# EAGLE design MD01 (EAGLE 5.07)
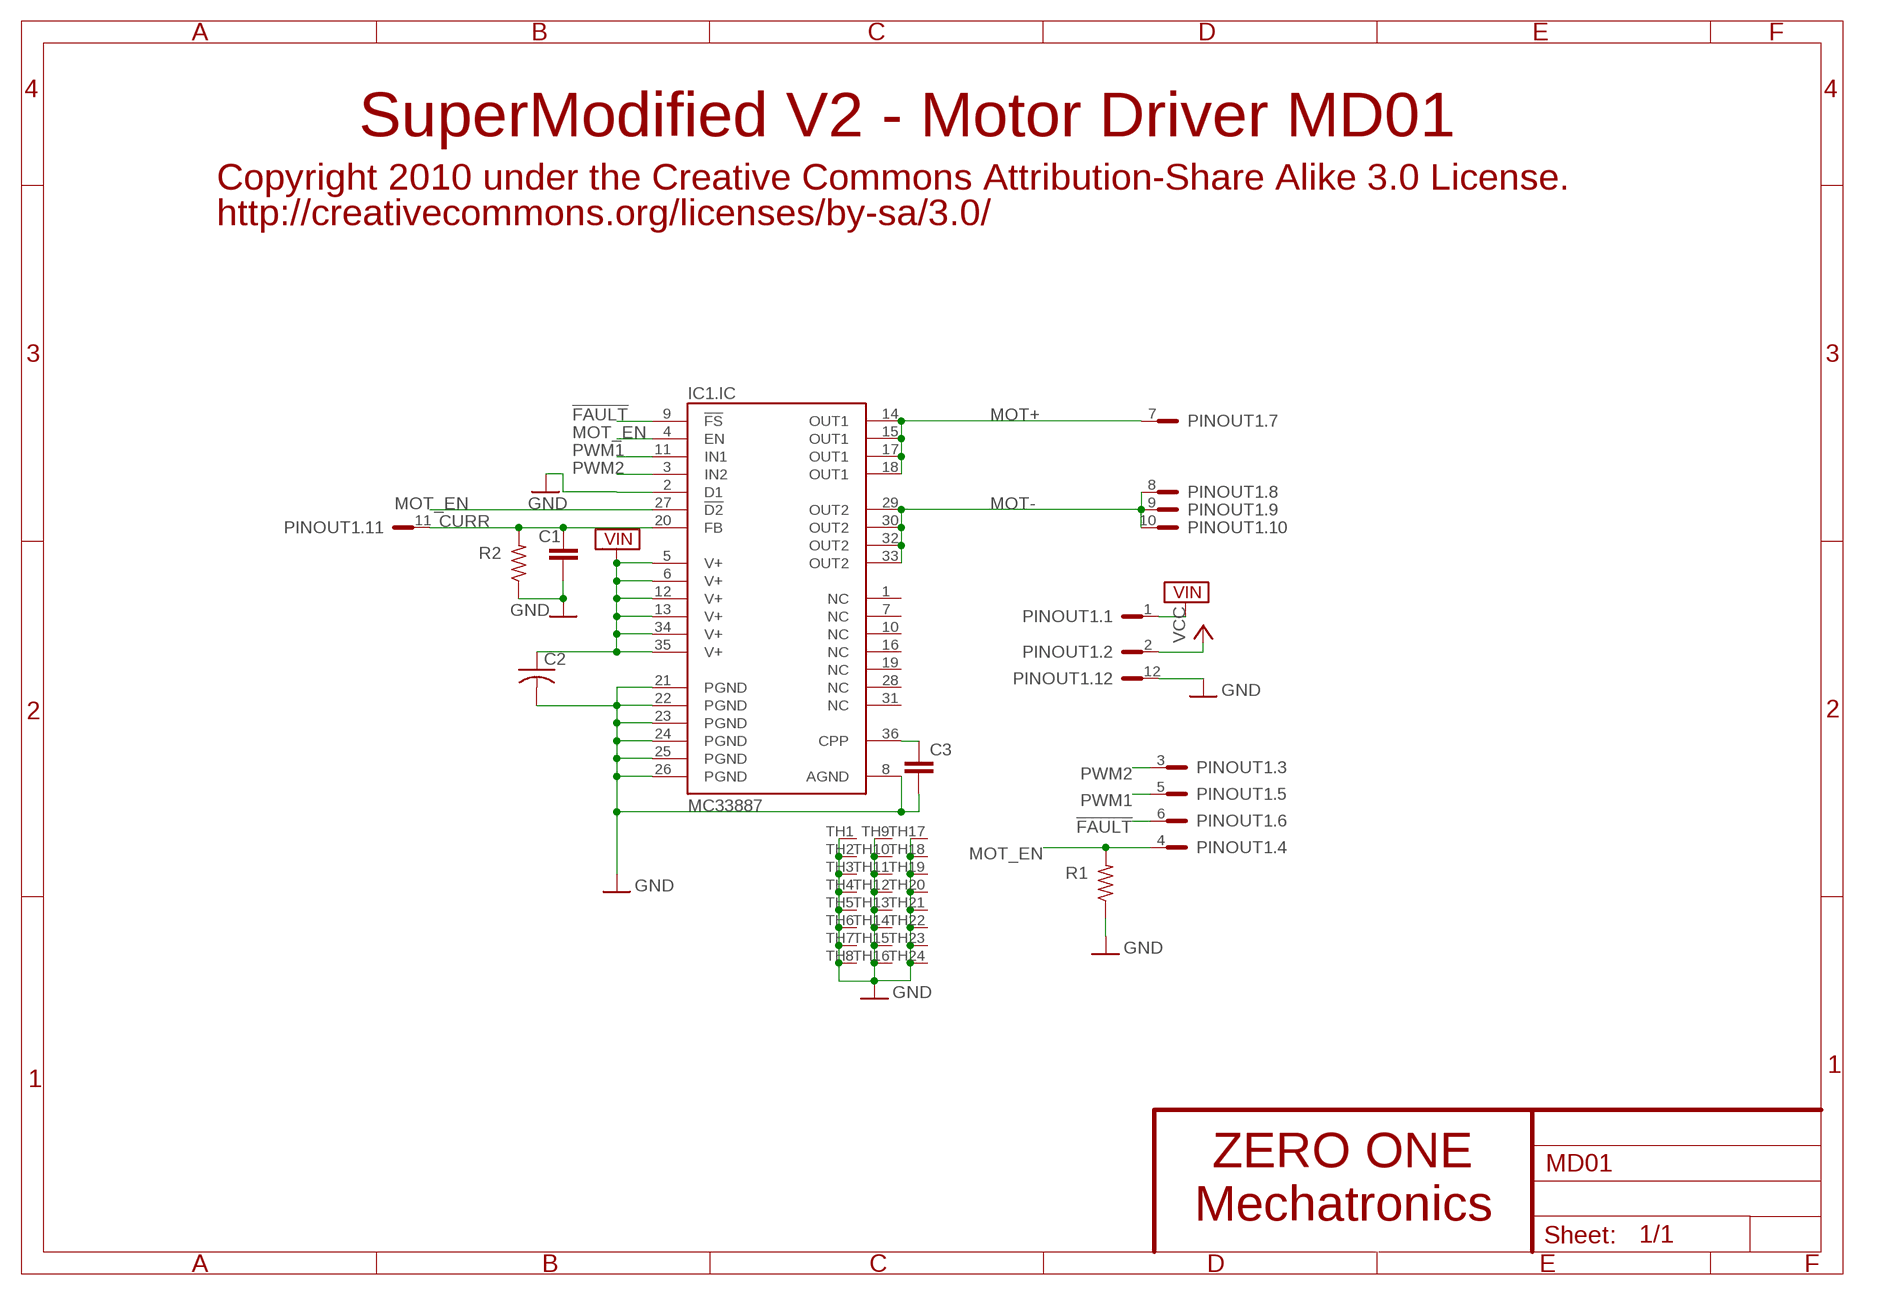
[diagram p0: schematic, sheet 1]

## Parts
C1  C-EUC0603K  [C0603K]
C2  C-USC3216  [C3216]
C3  C-EUC0402K  [C0402K]
IC1  MC33887  [PGFN-36]
PINOUT1  SMSPINS  [SMSPINS]
R1  R-US_R0402  [R0402]
R2  R-US_R0402  [R0402]

## Nets
!FAULT: IC1.9(.IC:!FS) PINOUT1.6
CURR: C1.1 IC1.20(.IC:FB) PINOUT1.11 R2.2
GND: C1.2 C2.2 C3.2 IC1.2(.IC:D1) IC1.8(.IC:AGND) IC1.21(.IC:PGND) IC1.22(.IC:PGND) IC1.23(.IC:PGND) IC1.24(.IC:PGND) IC1.25(.IC:PGND) IC1.26(.IC:PGND) IC1.TH1(.TH1:TH) IC1.TH2(.TH2:TH) IC1.TH3(.TH3:TH) IC1.TH4(.TH4:TH) IC1.TH5(.TH5:TH) IC1.TH6(.TH6:TH) IC1.TH7(.TH7:TH) IC1.TH8(.TH8:TH) IC1.TH9(.TH9:TH) IC1.TH10(.TH10:TH) IC1.TH11(.TH11:TH) IC1.TH12(.TH12:TH) IC1.TH13(.TH13:TH) IC1.TH14(.TH14:TH) IC1.TH15(.TH15:TH) IC1.TH16(.TH16:TH) IC1.TH17(.TH17:TH) IC1.TH18(.TH18:TH) IC1.TH19(.TH19:TH) IC1.TH20(.TH20:TH) IC1.TH21(.TH21:TH) IC1.TH22(.TH22:TH) IC1.TH23(.TH23:TH) IC1.TH24(.TH24:TH) PINOUT1.12 R1.1 R2.1
MOT+: IC1.14(.IC:OUT1) IC1.15(.IC:OUT1) IC1.17(.IC:OUT1) IC1.18(.IC:OUT1) PINOUT1.7
MOT-: IC1.29(.IC:OUT2) IC1.30(.IC:OUT2) IC1.32(.IC:OUT2) IC1.33(.IC:OUT2) PINOUT1.8 PINOUT1.9 PINOUT1.10
MOT_EN: IC1.4(.IC:EN) IC1.27(.IC:!D2) PINOUT1.4 R1.2
N$1: C3.1 IC1.36(.IC:CPP)
PWM1: IC1.11(.IC:IN1) PINOUT1.5
PWM2: IC1.3(.IC:IN2) PINOUT1.3
VCC: PINOUT1.2
VIN: C2.1 IC1.5(.IC:V+) IC1.6(.IC:V+) IC1.12(.IC:V+) IC1.13(.IC:V+) IC1.34(.IC:V+) IC1.35(.IC:V+) PINOUT1.1
Unconnected: IC1.1(.IC:NC) IC1.7(.IC:NC) IC1.10(.IC:NC) IC1.16(.IC:NC) IC1.19(.IC:NC) IC1.28(.IC:NC) IC1.31(.IC:NC)

## Notes on the sheet
- SuperModified V2 - Motor Driver MD01
- Copyright 2010 under the Creative Commons Attribution-Share Alike 3.0 License.
- http://creativecommons.org/licenses/by-sa/3.0/
- ZERO ONE
- Mechatronics

## Library data of the parts
C1 C3 = rcl:C-EU: CAPACITOR, European symbol
C2 = rcl:C-US: CAPACITOR, American symbol
IC1 = zo_TMS320DMC:MC33887
PINOUT1 = sms:SMSPINS
R1 R2 = rcl:R-US_: RESISTOR, American symbol

## Board
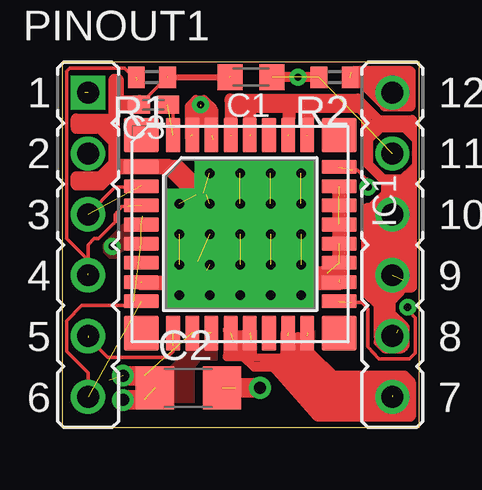
[diagram p1: board, top side]
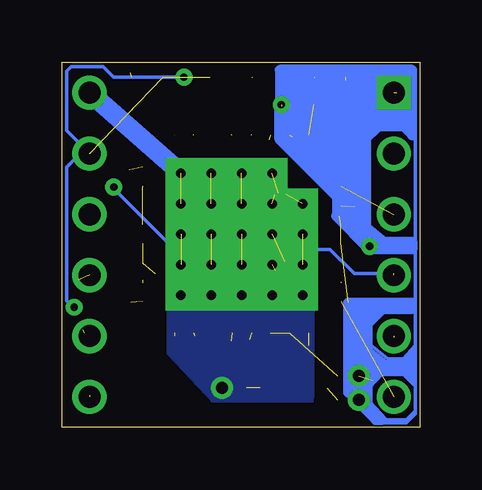
[diagram p2: board, bottom side, seen from below]

Size 14.91 x 15.23 mm. Coordinates in mm from the lower left corner, seen from the top.
Outline: 0,0 14.91,0 14.91,15.23 0,15.23 0,0
Copper layers (1*16): Top 0.035mm / dielectric 1.5mm / Bottom 0.035mm
Design rules "default": minimum track width 10mil, minimum drill 24mil, track to track 8mil, track to pad 8mil, pad to pad 8mil, via to via 8mil, smd to smd 8mil, copper to edge 40mil, drill to drill 8mil, minimum pad ring 10mil, minimum via ring 8mil, stop-mask expansion 4mil, vias tented up to drill 0mil, thermal gap 10mil

### Footprints (pad centres in the part's own frame; a part is rotated, then mirrored left to right if it is on the bottom)
C0603K = smd 1.05 x 1.08: 1 -0.875,0; 2 0.875,0
C3216 = smd 1.6 x 1.8: 1 -1.4,0; 2 1.4,0
C0402K = smd 0.925 x 0.74: 1 -0.6,0; 2 0.6,0
PGFN-36 = smd 1.448 x 1.448: 1 -4.127,-4.127; 10 4.127,-4.127; 19 4.127,4.127; 28 -4.127,4.127 | smd 0.584 x 1.448: 2 -2.8,-4.127; 3 -2,-4.127; 4 -1.2,-4.127; 5 -0.4,-4.127; 6 0.4,-4.127; 7 1.2,-4.127; 8 2,-4.127; 9 2.8,-4.127; 20 2.8,4.127; 21 2,4.127; 22 1.2,4.127; 23 0.4,4.127; 24 -0.4,4.127; 25 -1.2,4.127; 26 -2,4.127; 27 -2.8,4.127 | smd 1.448 x 0.584: 11 4.127,-2.8; 12 4.127,-2; 13 4.127,-1.2; 14 4.127,-0.4; 15 4.127,0.4; 16 4.127,1.2; 17 4.127,2; 18 4.127,2.8; 29 -4.127,2.8; 30 -4.127,2; 31 -4.127,1.2; 32 -4.127,0.4; 33 -4.127,-0.4; 34 -4.127,-1.2; 35 -4.127,-2; 36 -4.127,-2.8 | drill 0.4 pad 1.27 square: TH1 -2.54,2.54; TH2 -1.27,2.54; TH3 0,2.54; TH4 1.27,2.54; TH5 2.54,2.54; TH6 -2.54,1.27; TH7 -1.27,1.27; TH8 0,1.27; TH9 1.27,1.27; TH10 2.54,1.27; TH11 -2.54,0; TH12 -1.27,0; TH13 0,0; TH14 1.27,0; TH15 2.54,0; TH16 -2.54,-1.27; TH17 -1.27,-1.27; TH18 0,-1.27; TH19 1.27,-1.27; TH20 2.54,-1.27; TH21 -1.27,-2.54; TH22 0,-2.54; TH23 1.27,-2.54; TH24 2.54,-2.54
SMSPINS = drill 0.914 square: 1 -6.35,6.35 | drill 0.914 round: 2 -6.35,3.81; 3 -6.35,1.27; 4 -6.35,-1.27; 5 -6.35,-3.81; 6 -6.35,-6.35; 7 6.35,-6.35; 8 6.35,-3.81; 9 6.35,-1.27; 10 6.35,1.27; 11 6.35,3.81; 12 6.35,6.35
R0402 = smd 0.7 x 0.9: 1 -0.65,0; 2 0.65,0

### Placement (x,y rotation side)
C1  7.87,14.61 180 top
C2  5.27,1.65 0 top
C3  3.81,13.46 180 top
IC1  7.43,8.06 270 top
PINOUT1  7.43,7.62 0 top
R1  3.75,14.61 180 top
R2  11.37,14.61 180 top

### Tracks (layer width: path | path; a pad name or v marks a point on that pad's centre or on a via)
!FAULT  (1 unrouted)
CURR  (via drill 0.3 pad 0.03)  (5 unrouted)
  Top 0.152: 14.41,4.95 14.67,4.64 14.73,4.57 14.73,3.11 14.48,2.86 13.21,2.86 12.76,3.37 12.76,4.95 12.51,5.21 12.06,5.21
  Top 0.406: 10.73,14.61 v9.84,14.61 8.76,14.61
  Bottom 0.152: 14.41,4.95 14.73,5.27 14.73,10.86 14.16,11.43 PINOUT1.11 14.73,12.38 14.73,14.86 14.54,15.05 13.21,15.05 12.76,14.61 v9.84,14.61
FAULT
  Top 0.152: 2.73,5.08 0.83,5.08 0.19,4.45 0.19,3.17 1.08,2.29 1.08,1.21
GND  (via drill 0.5)  (25 unrouted)
  Top 0.152: 3.24,13.46 4.38,14.61
  Top 0.254: 4.38,14.61 6.99,14.61
  Top 0.406: 12,14.61 13.21,14.61 PINOUT1.12 | 3.24,13.46 2.16,13.46 2.16,12.89 0.57,12.89 0.57,12.51 2.16,12.51 | 2.16,10.92 2.16,12.51 | 2.16,10.92 2.22,10.92 | 2.22,10.92 3.3,10.92 | 2.22,10.92 IC1.2 | 3.24,13.53 3.24,13.65 2.35,13.65 2.35,14.54 2.16,14.54 2.16,12.51 | 2.29,10.79 2.16,10.92 | 2.35,10.79 4.25,10.79 4.45,10.99 2.22,10.99 | 2.22,10.99 2.1,10.99 1.59,10.48 0.57,10.48 0.57,10.1 1.65,10.1 2.35,10.79 | 2.35,10.79 2.29,10.79 | 2.29,10.79 2.29,10.92 2.22,10.99 | 2.22,11.81 2.22,13.27 | 2.22,13.27 2.29,13.34 | 2.29,13.34 2.86,13.34 | 2.29,13.34 2.22,13.34 2.22,13.27 | 2.22,10.99 2.22,11.81 | 2.22,11.81 1.59,12.45 0.57,12.45 | 12.06,14.8 12.13,14.86 14.54,14.86 14.54,13.4 13.46,13.4 12.57,14.29 12.38,14.41 12.95,14.54 14.22,14.54 14.22,13.65 13.91,13.65 13.91,14.29 12.95,14.29
  Top 0.61: 4.76,6.03 3.3,6.03 | IC1.2 4.45,10.86 5.59,9.72 | 11.56,6.16 11.56,10.03 | 5.65,9.78 5.65,6.92 4.76,6.03 | 4.76,6.03 11.43,6.03 | 11.43,6.03 11.56,6.03 | 11.43,6.03 11.05,6.41 5.71,6.41 5.65,6.48 5.97,6.48 6.03,6.54 6.03,9.72 5.97,9.78 5.91,9.78 4.83,10.86 4.76,10.86 | 4.76,10.86 2.35,10.86 | 4.76,10.86 5.91,9.72 5.91,6.41 5.84,6.35
  Top 0.813: 7.24,1.65 v8.26,1.65
  Bottom 0.813: PINOUT1.12 IC1.TH1 IC1.TH6 IC1.TH11 IC1.TH16
  pour Bottom (no thermals): 8.57,0.95 10.54,3.05 10.54,6.22 4.38,6.22 4.45,0.19 7.87,0.19
  pour Top (no thermals): 12,15.05 12.13,15.18 14.67,15.18 14.86,14.99 14.86,12.64 14.22,13.27 13.53,13.27 13.46,13.27 12.57,14.16 11.94,14.16 11.94,14.99
  pour Top (no thermals): 2.86,13.84 2.54,13.84 2.54,14.67 1.97,14.67 1.97,13.14 1.97,13.08 0.38,13.08 0.38,12 0.64,12.26 1.46,12.26 1.91,11.81 1.91,11.11 1.46,10.67 0.76,10.67 0.38,11.05 0.38,9.91 1.71,9.91 2.41,10.6 3.37,10.6 3.37,11.18 2.41,11.18 2.41,13.14 3.56,13.14 3.56,13.84
MOT+  (5 unrouted)
  Top 0.152: 7.11,3.68 7.11,3.49 7.11,2.98 7.81,2.98 7.87,2.98 | 7.87,2.98 7.87,3.62 | 7.87,2.98 7.87,2.67 9.21,2.67 9.4,2.67 | 9.4,2.67 9.4,3.05 9.4,3.81 | 9.4,2.67 10.22,2.67 | 10.22,2.67 10.22,2.92 | 10.22,3.56 10.22,3.81 | 10.22,2.67 10.22,1.84 10.73,1.33 13.78,1.33
  Top 0.305: 6.86,2.92 7.56,2.92 | 8.32,2.92 10.03,2.92 11.56,1.4 11.18,1.4 9.97,2.6 9.27,2.6 9.21,2.67 9.27,2.67 10.6,1.33 11.94,1.33 12.13,1.52 12.13,1.78 12.06,1.84 10.41,1.84 | 10.41,1.84 9.78,2.48 | 10.41,1.84 10.73,1.52 11.87,1.52 11.94,1.59 10.48,1.59 9.59,2.48 8,2.48 7.56,2.92 | 7.56,2.92 8.32,2.92 | 8.32,2.92 8.51,2.73
  Top 0.61: 10.22,3.56 10.22,3.05 | 10.22,3.05 10.22,2.92 | 9.4,3.87 9.4,3.05 10.22,3.05 | 7.75,3.49 7.11,3.49 7.11,3.75 7.81,3.75 7.81,3.17 | 7.81,2.98 7.81,3.17 | 7.81,3.17 7.05,3.17 7.05,3.81
  pour Top: 14.54,1.02 14.54,1.84 14.1,2.35 11.24,2.35 10.54,3.05 10.54,4.7 9.14,4.7 9.14,2.98 8.13,2.98 8.13,4.7 6.73,4.7 6.73,2.79 7.56,2.79 7.94,2.35 8.7,2.35 10.41,0.51 14.16,0.51
  pour Top (no thermals): 10.73,2.86 10.54,3.05 10.54,3.94 9.14,3.94 9.14,2.98 8.13,2.98 8.13,3.94 6.73,3.94 6.73,2.79 10.73,2.79
MOT-  (6 unrouted)
  Top 0.152: PINOUT1.8 PINOUT1.10 13.78,10.1 12.83,10.99 12.83,11.05 | 12.83,12.13 12.83,13.21 10.29,13.21 10.22,13.21 | 10.22,13.21 IC1.29 | 10.22,13.21 9.53,13.21 9.46,13.21 | 9.46,13.21 9.46,12.19 | 9.46,13.21 7.87,13.21 7.75,13.21 | 7.87,12.83 7.87,12.19 | 7.11,13.21 7.05,13.21 7.05,12.19 | 14.73,12.32 14.73,10.67 14.61,10.67 14.1,10.35 14.03,10.35 | 14.03,10.35 13.97,10.35 | 14.67,10.99 14.03,10.35 | 14.67,10.99 14.67,11.94 | 14.67,12 14.67,12.06 | 14.67,12.06 14.16,12.57 14.16,12.51 14.67,12 | 14.67,11.94 14.67,12 | 14.67,11.94 14.29,12.32 | 14.29,12.32 14.16,12.45 | 14.29,12.32 14.54,12.32 14.41,12.38 | 14.41,12.38 13.27,12.38 | 14.41,12.38 14.54,12.38 14.67,12.06 | 14.67,10.99 14.67,10.48 13.34,10.48 12.89,10.92 12.83,11.05 | 12.83,11.05 12.83,12.13 | 12.83,12.13 12.89,12.19 12.89,10.99
  Top 0.406: PINOUT1.8 13.21,3.81 | 13.21,3.81 13.21,4.06 | 13.21,4.06 13.21,5.08 12.7,5.59 12.7,9.02 12.76,9.02 13.53,9.78 13.53,10.22 | 12.7,12.64 12.7,13.02 12.38,13.34 10.16,13.34 | 9.53,13.34 9.4,13.34 | 6.99,13.34 7.87,13.34 | 6.99,13.34 6.99,12.83 7.11,12.83 7.11,13.21 7.75,13.21 7.75,12.83 7.87,12.83 7.87,13.21 7.87,13.34 | 7.87,13.34 9.4,13.34 | 9.4,13.34 9.4,12.89 9.53,12.89 9.53,13.21 9.53,13.34 | 9.53,13.34 10.16,13.34 | 10.16,13.34 10.16,12.83 10.29,12.83 10.29,13.21 10.29,13.59 6.99,13.59 | 6.99,13.59 6.99,13.34 | 6.99,13.59 6.99,13.72 12.32,13.72 13.21,12.83 14.61,12.83 14.61,12.26 14.54,12.32 14.29,12.57 14.16,12.57 13.34,12.57 12.7,11.94 | 12.7,11.94 12.7,12.64 | 12.7,12.64 13.02,12.64 12.7,11.94 | 12.7,11.94 12.7,11.05 13.53,10.22 | 13.53,10.22 13.53,10.29 14.16,10.29 14.61,10.73 14.61,10.67 14.61,5.84 14.22,5.84 13.72,5.27 13.72,4.76 | 13.72,4.76 13.72,4.64 | 13.72,4.76 14.29,4.19 14.29,3.43 14.16,3.3 13.46,3.3 13.21,3.56 13.21,3.81 | 13.21,4.06 14.03,4.06 13.46,4.38 13.46,5.33 12.89,5.91 13.02,5.91 13.02,8.95 13.65,9.53 13.65,5.46 13.27,5.91 13.27,9.14 | 13.27,9.14 13.27,9.27 | 13.27,9.14 12.7,9.14 | 13.27,9.14 13.91,9.14 | 13.91,9.14 13.91,10.03 | 13.91,9.14 13.91,5.65 14.22,6.16 14.22,10.22 | 13.46,3.62 14.03,3.62 14.03,3.87 13.97,3.94
MOT_EN  (via drill 0.3 pad 0.03)  (5 unrouted)
  Top 0: 12.76,10.29 12.76,10.41
  Top 0.152: 2.73,9.21 2.48,9.21 2.22,8.89 2.22,8.57 1.52,7.87 1.33,7.87 1.08,7.62 1.08,6.99 | PINOUT1.4 1.08,6.99 | 1.08,6.99 0.19,7.87 0.19,14.86 0.32,14.99 2.6,14.99 3.11,14.48 | v12.76,10.03 12.76,10.29 12.32,10.73 12.13,10.73
  Bottom 0.152: v12.76,10.03 12.76,9.97 10.22,7.43 3.75,7.43 2.73,6.41 1.08,6.41
N$1  (1 unrouted)
N$2
  Top 0.61: 9.84,2.79 9.84,3.68
N$3  (via drill 0.5)
  other vias: 2.54,2.16
N$4
  Top 0.61: 10.03,3.3 11.56,1.78
N$5
  Top 0.61: 9.02,2.48 10.35,1.02 14.1,1.02 14.1,2.03 12.45,2.03 12.45,1.59 13.91,1.59
N$6  (via drill 0.3 pad 0.03)
  other vias: 14.41,5.02
N$7
  Top 0.406: 6.92,4.06 6.92,2.98
N$8
  Top 0.406: 8.76,2.6 10.48,0.7 14.1,0.7 14.22,0.83 14.22,2.16 11.24,2.16
N$9
  Top 0.406: 14.29,2.16 14.54,1.91 14.54,0.45 10.67,0.45 8.83,2.54
N$11
  Top 0.152: 4.64,12.19 4.64,13.46 4.45,13.46
N$12
  Bottom 0.406: 2.03,7.75 0.32,7.75 0.32,7.43 2.1,7.43 3.49,8.83
N$13
  Bottom 0.406: 0.32,13.02 0.32,14.92 5.84,14.92 5.84,12.64 3.05,9.91 3.05,8.89 2.22,8.06 2.22,12.89 | 2.22,12.89 0.32,12.89 | 2.22,12.89 5.46,12.89 5.46,14.67 0.38,14.67 0.38,13.14 5.21,13.14 5.21,14.35 0.64,14.35 0.64,14.03 | 0.64,13.78 0.64,13.4 4.89,13.4 4.95,14.03 0.64,14.03 | 0.64,14.03 0.64,13.78 | 0.64,13.78 4.7,13.78 5.46,12.64 2.41,12.64 2.35,8.64 2.67,9.02 2.67,12.38 3.37,12.38 | 3.37,12.38 5.14,12.38 2.92,10.1 2.92,12.19 4.57,12.19 3.17,10.73 3.24,11.94 3.94,11.94 3.37,11.43 3.37,12.38 | 3.37,12.38 2.35,11.94 1.71,12.57 | 1.71,12.57 0.7,12.57 | 0.7,12.57 0.32,12.57 | 1.91,12.57 1.71,12.57 | 0.7,12.57 0.32,12.19
N$14
  Bottom 0.406: 2.41,8.51 1.59,7.81
PWM1  (2 unrouted)
  Top 0.152: 1.08,3.75 1.91,2.92 4.38,2.92 4.64,3.17 4.64,3.43
PWM2  (1 unrouted)
  Top 0.152: 3.3,10.03 2.22,10.03 PINOUT1.3
VIN  (via drill 0.3 pad 0.03, 0.5)  (11 unrouted)
  Top 0.406: 6.29,12 6.29,13.27 5.91,13.65 5.59,13.65 5.33,13.4 5.33,12.13 5.52,12.13 5.52,13.14 5.71,13.34 5.91,13.34 6.1,13.14 6.1,12.89 6.03,12.83 5.78,12.83 5.78,13.4
  Top 0.813: v2.54,1.14 3.43,1.14 | 2.54,2.16 3.43,2.16
  Bottom 0.152: v2.54,1.14 1.52,0.19 0.57,0.19 0.19,0.57 0.19,1.71 | 0.19,3.24 0.19,1.97 | 0.19,3.43 0.19,13.21 0.95,13.97 | 1.4,0.32 1.71,0.32 | 0.25,0.64 0.57,0.32 1.4,0.32 | 1.4,0.32 2.1,1.08 2.1,1.65 1.59,2.22 0.7,2.22 0.19,1.71 | 0.19,1.97 0.19,1.71 | 0.19,1.97 0.25,1.97 0.64,2.35 0.64,2.48 0.25,2.1 0.25,3.24 0.19,3.24 | 0.19,3.43 0.19,3.24 | 0.19,3.43 0.7,2.86 1.33,2.86 2.1,3.49 2.1,3.3 1.4,2.73 0.7,2.73 0.32,3.11 0.32,2.35 1.65,2.35 1.97,1.97 1.97,3.11 1.46,2.67 0.64,2.67 0.38,2.86 0.38,2.48 1.84,2.48 | 1.84,2.48 1.84,2.22 | 1.84,2.48 1.84,2.92 1.71,2.79 1.71,2.67 | 1.71,2.35 1.71,2.67 | 1.71,2.67 0.45,2.67 0.45,2.6 1.65,2.6
  Bottom 0.406: 0.32,5.21 2.98,5.21 2.98,1.46 1.84,0.32 1.71,0.32 1.59,0.32 2.67,1.4 2.67,4.95 2.41,4.95 | 2.41,4.95 0.32,4.95 | 2.41,4.95 2.41,1.21 2.16,0.95 2.16,4.89 1.46,5.02 2.29,4.19
  Bottom 0.61: v5.78,13.46 5.78,12.06 3.37,9.65 3.37,8.83 v2.1,7.56
  pour Top (no thermals): 2.6,8.57 1.71,7.68 1.71,7.3 1.97,7.05 2.16,7.05 2.29,7.05 2.6,7.37 2.86,7.37 2.86,8.64 2.67,8.64
  pour Top (no thermals): 5.14,12.76 5.14,13.14 5.14,13.34 5.59,13.78 5.97,13.78 6.48,13.27 6.48,12.7 6.48,12.64 5.14,12.64
  pour Top (no thermals): 5.14,3.49 6.48,3.49 6.48,2.86 6.48,2.79 5.78,2.79 5.52,2.48 5.52,0.76 3.37,0.76 3.37,2.54 4.51,2.54 5.14,3.17